# EAGLE design Proto_RS485_ISO (EAGLE 8.5.2)
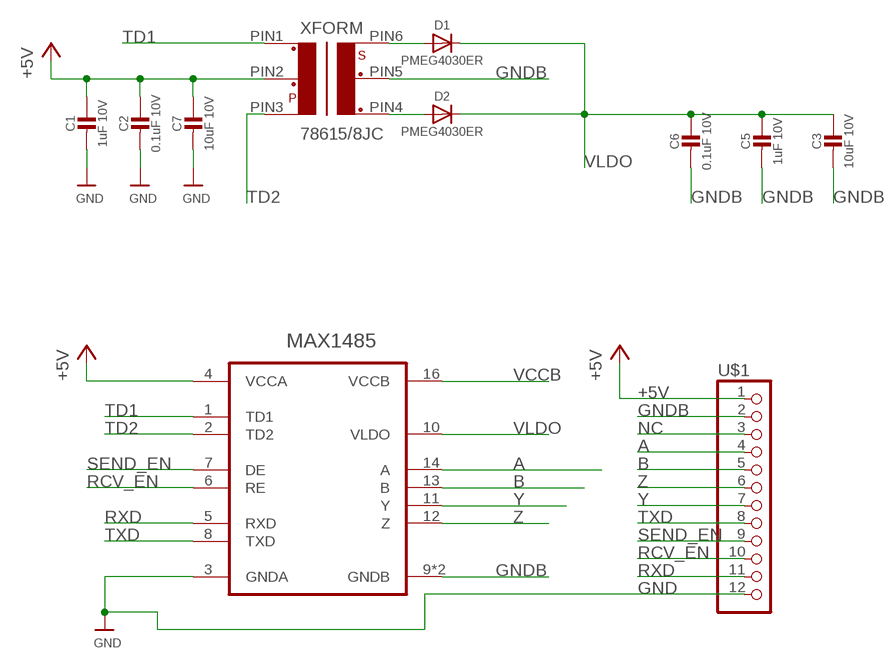
[diagram p0: schematic, sheet 1]

## Parts
C1  1uF 10V  CAP_CERAMIC0603MINI  [0603-MINI]
C2  0.1uF 10V  CAP_CERAMIC0603MINI  [0603-MINI]
C3  10uF 10V  CAP_CERAMIC0603MINI  [0603-MINI]
C5  1uF 10V  CAP_CERAMIC0603MINI  [0603-MINI]
C6  0.1uF 10V  CAP_CERAMIC0603MINI  [0603-MINI]
C7  10uF 10V  CAP_CERAMIC0603MINI  [0603-MINI]
D1  PMEG4030ER  DIODESOD-123  [SOD-123]
D2  PMEG4030ER  DIODESOD-123  [SOD-123]
MAX1485  MAX14853GWE+  [SOIC127P1034X267-16N]
U$1  PINHD-1X12  [1X12]
XFORM  78615/8JC  [0.1_SMD]

## Nets
+5V: C1.1 C2.1 C7.1 MAX1485.4(VCCA) U$1.1 XFORM.PIN2
A: MAX1485.14(A) U$1.4
B: MAX1485.13(B) U$1.5
GND: C1.2 C2.2 C7.2 MAX1485.3(GNDA) U$1.12
GNDB: C3.2 C5.2 C6.2 MAX1485.9(GNDB) MAX1485.15(GNDB) U$1.2 XFORM.PIN5
N$1: D1.A XFORM.PIN6
N$2: D2.A XFORM.PIN4
NC: U$1.3
RCV_EN: MAX1485.6(RE) U$1.10
RXD: MAX1485.5(RXD) U$1.11
SEND_EN: MAX1485.7(DE) U$1.9
TD1: MAX1485.1(TD1) XFORM.PIN1
TD2: MAX1485.2(TD2) XFORM.PIN3
TXD: MAX1485.8(TXD) U$1.8
VCCB: MAX1485.16(VCCB)
VLDO: C3.1 C5.1 C6.1 D1.C D2.C MAX1485.10(VLDO)
Y: MAX1485.11(Y) U$1.7
Z: MAX1485.12(Z) U$1.6

## Library data of the parts
C1-C3 C5-C7 = microbuilder:CAP_CERAMIC: Ceramic Capacitors For new designs, use the packages preceded by an '_' character since they are more reliable: The following footprints should be used on most boards: _0402 - Standard footprint for regular board layouts _0603 - Standard footprint for regular board layouts _0805 - Standard footprint for regular board layouts _1206 - Standard footprint for regular board layouts For extremely tight-pitch boards where space is at a premium, the following 'micro-pitch' footprints can be used (smaller pads, no silkscreen outline, etc.): _0402MP - Micro-pitch footprint for very dense/compact boards _0603MP - Micro-pitch footprint for very dense/compact boards _0805MP - Micro-pitch footprint for very dense/compact boards _1206MP - Micro-pitch footprint for very dense/compact boards
D1 D2 = microbuilder:DIODE: Diode SMA Model Volts Amps Type Vf Ir Digikey # Notes SSA34-E3 40V 3A Schottky 480mV @ 3A 200uA @ 40V SSA34-E3/61TGITR-ND CDBA120-G 20V 1A Schottky 500mV @ 1A 500uA @ 20V 641-1014-6-ND REEL MBRA210 10V 2A Schottky 350mV @ 2A 700uA @ 10V MBRA210LT3 SOD-123 Model Volts Amps Type Vf Ir Order # Notes BAT54T1G 30V 200mA Schottky 800mV @ 200mA 2uA @ 25V BAT54T1GOSTR-ND B0530W 30V 500mA Schottky 430mV @ 500mA 130uA @ 30V B0530W-FDICT-ND REEL MBR120 20V 1A Schottky 340mV @ 1A MBR120VLSFT1GOSCT-ND SOD-323 Model Volts Amps Type Vf Ir Order # Notes PMEG2005EJ 20V 500mA Schottky 355mV @ 500mA 568-4110-1-ND ZLLS410 10V 570mA Schottky 380mV @ 570mA ZLLS410CT-ND 1N4148WS 75V 150mA Silicon/Simple 1V 1N4148WSFSCT-ND REEL SOD-523 Model Volts Amps Type Vf Ir Order # Notes BAT54XV2 30V 200mA Schottky 0.8V @ 100mA BAT54XV2CT-ND TB751S 30V 30mA Schottky RB751S-40TE61CT-ND SOT23-R/W (R = Solder Paste/Reflow Ovens, W = Hand-Soldering) Model Volts Amps Type Vf Ir Order # Notes BAT54FILM 40V 300mA Schottky 497-7162-1-ND POWERDI-5 Model Volts Amps Type Vf Ir Order # Notes PDS560 60V 5A Schottky 670mV @ 5A 150uA @ 60V PDS560DICT-ND
MAX1485 = Maxim_By_element14_Batch_1:MAX14853GWE+: Isolated RS-485 Tranceiver
U$1 = adafruit:PINHD-1X12: PIN HEADER
XFORM = trafo-murata:78615/8JC

## Board
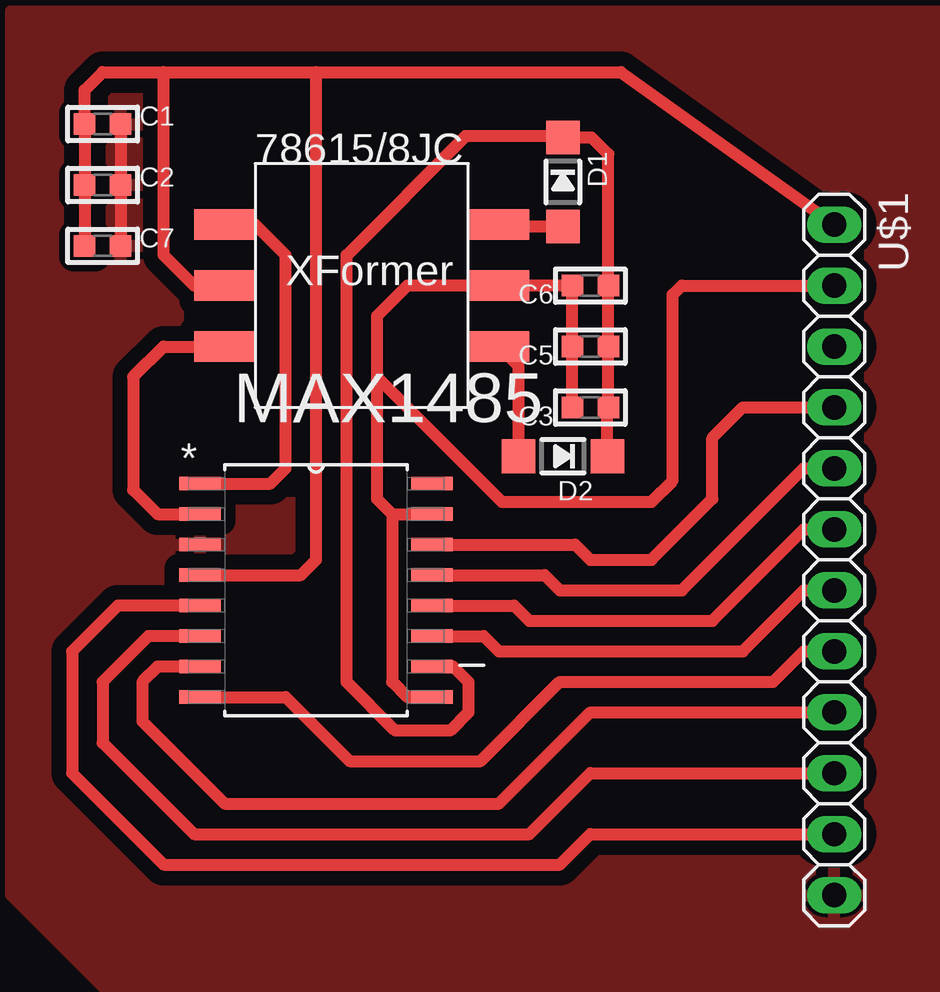
[diagram p1: board, top side]

No outline drawn. Coordinates in mm, seen from the top.
Copper layers (1*16): Top 0.035mm / dielectric 1.5mm / Bottom 0.035mm
Design rules "OthermillDRC_30_deg_v2": minimum track width 6mil, minimum drill 0.8mm, track to track 6mil, track to pad 6mil, pad to pad 6mil, via to via 6mil, smd to smd 0mil, copper to edge 0mil, drill to drill 6mil, minimum pad ring 10mil, minimum via ring 10mil, stop-mask expansion 1mil, vias tented up to drill 30mil, thermal gap 6mil

### Footprints (pad centres in the part's own frame; a part is rotated, then mirrored left to right if it is on the bottom)
0603-MINI = smd 0.9 x 0.9: 1 -0.75,0; 2 0.75,0
SOD-123 = smd 1.4 x 1.4: A 1.85,0; C -1.85,0
SOIC127P1034X267-16N = smd 1.727 x 0.559: 1 -4.826,4.445; 2 -4.826,3.175; 3 -4.826,1.905; 4 -4.826,0.635; 5 -4.826,-0.635; 6 -4.826,-1.905; 7 -4.826,-3.175; 8 -4.826,-4.445; 9 4.826,-4.445; 10 4.826,-3.175; 11 4.826,-1.905; 12 4.826,-0.635; 13 4.826,0.635; 14 4.826,1.905; 15 4.826,3.175; 16 4.826,4.445
1X12 = drill 1.016 long: 1 -13.97,0; 2 -11.43,0; 3 -8.89,0; 4 -6.35,0; 5 -3.81,0; 6 -1.27,0; 7 1.27,0; 8 3.81,0; 9 6.35,0; 10 8.89,0; 11 11.43,0; 12 13.97,0
0.1_SMD = smd 2.54 x 1.27: PIN1 -11.43,1.27; PIN2 -11.43,-1.27; PIN3 -11.43,-3.81; PIN4 0,-3.81; PIN5 0,-1.27; PIN6 0,1.27

### Placement (x,y rotation side)
C1  7.62,41.02 0 top
C2  7.62,38.48 0 top
C3  27.94,29.21 180 top
C5  27.94,31.75 180 top
C6  27.94,34.29 180 top
C7  7.62,35.94 0 top
D1  26.8,38.61 270 top
D2  26.8,27.18 180 top
MAX1485  16.51,21.59 0 top
U$1  38.1,22.86 270 top
XFORM  24.13,35.56 0 top

### Tracks (layer width: path | path; a pad name or v marks a point on that pad's centre or on a via)
+5V
  Top 0.508: C7.1 C2.1 C1.1 6.87,42.43 7.62,43.18 10.16,43.18 | 10.16,43.18 16.51,43.18 | 16.51,43.18 29.21,43.18 U$1.1 | XFORM.PIN2 11.43,34.29 10.16,35.56 10.16,43.18 | MAX1485.4 15.88,22.23 16.51,22.86 16.51,43.18
A
  Top 0.508: MAX1485.14 27.3,23.5 27.94,22.86 30.48,22.86 33.02,25.4 33.02,27.94 34.29,29.21 U$1.4
B
  Top 0.508: MAX1485.13 26.04,22.23 26.67,21.59 31.75,21.59 36.83,26.67 U$1.5
GND
  Top 0.508: C1.2 C7.2
  pour Top (isolate 0.61): 3.81,45.72 43.18,45.72 43.18,5.08 7.62,5.08 3.81,8.89
GNDB
  Top 0.508: 19.05,30.48 19.05,33.02 20.32,34.29 XFORM.PIN5 C6.2 C5.2 C3.2 | 19.05,30.48 19.05,25.4 19.68,24.77 | 19.68,24.77 19.68,17.78 20.32,17.14 MAX1485.9 | 19.05,30.48 24.26,25.27 30.48,25.27 31.37,26.16 31.37,33.91 31.75,34.29 U$1.2 | 19.68,24.77 MAX1485.15
N$1
  Top 0.508: XFORM.PIN6 24.2,36.76 D1.A
N$2
  Top 0.508: D2.A 24.95,30.93 XFORM.PIN4
RCV_EN
  Top 0.508: MAX1485.6 9.53,19.68 7.62,17.78 7.62,15.24 11.43,11.43 25.4,11.43 27.94,13.97 U$1.10
RXD
  Top 0.508: MAX1485.5 8.26,20.95 6.35,19.05 6.35,13.97 10.16,10.16 26.67,10.16 27.94,11.43 U$1.11
SEND_EN
  Top 0.508: MAX1485.7 9.91,18.41 9.27,17.78 9.27,16.13 12.7,12.7 24.13,12.7 27.94,16.51 U$1.9
TD1
  Top 0.508: MAX1485.1 14.61,26.04 15.24,26.67 15.24,35.56 13.97,36.83 XFORM.PIN1
TD2
  Top 0.508: XFORM.PIN3 10.16,31.75 8.89,30.48 8.89,25.78 9.91,24.77 MAX1485.2
TXD
  Top 0.508: MAX1485.8 15.24,17.14 17.91,14.48 23.37,14.48 26.67,17.78 35.56,17.78 36.83,19.05 U$1.8
VLDO
  Top 0.508: MAX1485.10 22.23,18.41 22.86,17.78 22.86,16.51 22.1,15.75 19.81,15.75 17.78,17.78 17.78,35.56 22.73,40.51 26.74,40.51 D1.C 28,40.46 28.69,39.76 C6.1 C5.1 C3.1 28.7,29.2 28.65,29.14 D2.C
Y
  Top 0.508: MAX1485.11 23.5,19.68 24.13,19.05 34.29,19.05 36.83,21.59 U$1.7
Z
  Top 0.508: MAX1485.12 24.77,20.95 25.4,20.32 33.02,20.32 36.83,24.13 U$1.6